# EAGLE schematic UHF-RLB (EAGLE 5.07)
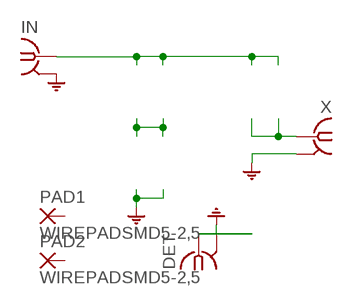
[diagram p0: schematic, sheet 1]

## Parts
DET  SMA-142-0711-871/876  [J502-ND-142-0711-871/876]
IN  SMA-142-0711-871/876  [J502-ND-142-0711-871/876]
PAD1  WIREPADSMD5-2,5  [5-2,5]
PAD2  WIREPADSMD5-2,5  [5-2,5]
X  SMA-142-0711-871/876  [J502-ND-142-0711-871/876]

## Nets
GND: DET.G@1(GND) IN.G@1(GND) X.G@1(GND)
N$1: IN.1
N$3: X.1
N$4: DET.1
Unconnected: PAD1.1(P) PAD2.1(P)

## Power pins joined to a net without a drawn wire
GND: DET.G@2(GND) DET.G@3(GND) DET.G@4(GND) IN.G@2(GND) IN.G@3(GND) IN.G@4(GND) X.G@2(GND) X.G@3(GND) X.G@4(GND)

## Library data of the parts
DET IN X = dtoy-RF:SMA-: SMA 50 Ohm End Launch Jack Receptacle - Round Contact Johnson Components Source: www.johnsoncomponents.com .. J502-ND.pdf
PAD1 PAD2 = wirepad:WIREPAD: Wire PAD connect wire on PCB